# Altium project ICSP-PROG-PIN-1.5-2.54.PrjPcb
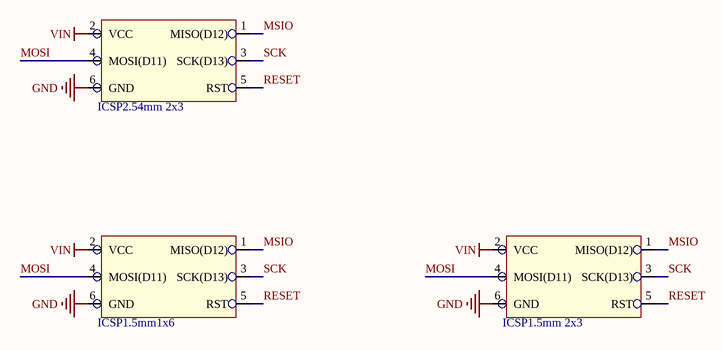
[diagram p0: ICSP-PROG-PIN-1.5-2.54.SchDoc]
1 sheet, 3 parts. Net scope: global (net labels, ports and power ports of the same name join across sheets).
Board file: ICSP-PROG-PIN-1.5-2.54.PcbDoc

## Sheet ICSP-PROG-PIN-1.5-2.54.SchDoc: FFT Progrmmer pins
size 210 x 147 mm; Author: Artis Kirsteins; Organization: FFT; Address1: Tukums; Address2: Latvia; Revision: A; SheetNumber: 1; SheetTotal: 1; ID: 1.5mm to 2.54mm

### Parts
ICSP1.5mm1x6  ICSP pad  [ICSP prg PAD 1.5mm 1Line]  (value not drawn)  (no BOM)
ICSP1.5mm_2x3  ICSP pad  [ICSP prg PAD 1.5mm]  (value not drawn)  (no BOM)
ICSP2.54mm_2x3  ICSP pad  [ICSP prg PIN 2.54mm]  (value not drawn)  (no BOM)

### Nets
GND: ICSP1.5mm1x6.6(GND) ICSP1.5mm_2x3.6(GND) ICSP2.54mm_2x3.6(GND)
VIN: ICSP1.5mm1x6.2(VCC) ICSP1.5mm_2x3.2(VCC) ICSP2.54mm_2x3.2(VCC)
MOSI: ICSP1.5mm1x6.4(MOSI(D11)) ICSP1.5mm_2x3.4(MOSI(D11)) ICSP2.54mm_2x3.4(MOSI(D11))
MSIO: ICSP1.5mm1x6.1(MISO(D12)) ICSP1.5mm_2x3.1(MISO(D12)) ICSP2.54mm_2x3.1(MISO(D12))
RESET: ICSP1.5mm1x6.5(RST) ICSP1.5mm_2x3.5(RST) ICSP2.54mm_2x3.5(RST)
SCK: ICSP1.5mm1x6.3(SCK(D13)) ICSP1.5mm_2x3.3(SCK(D13)) ICSP2.54mm_2x3.3(SCK(D13))

### Notes on the sheet
- Title:
- ID:
- Date:
- Time:
- Revision:
- Tukums
- FFT
- Latvia
- Artis Kirsteins
- File:

### Library data of the parts
ICSP1.5mm1x6 ICSP1.5mm_2x3 ICSP2.54mm_2x3 = Progr ICSP: PAD prog